# EAGLE design digitalLatchShieldSMD (EAGLE 7.3.0)
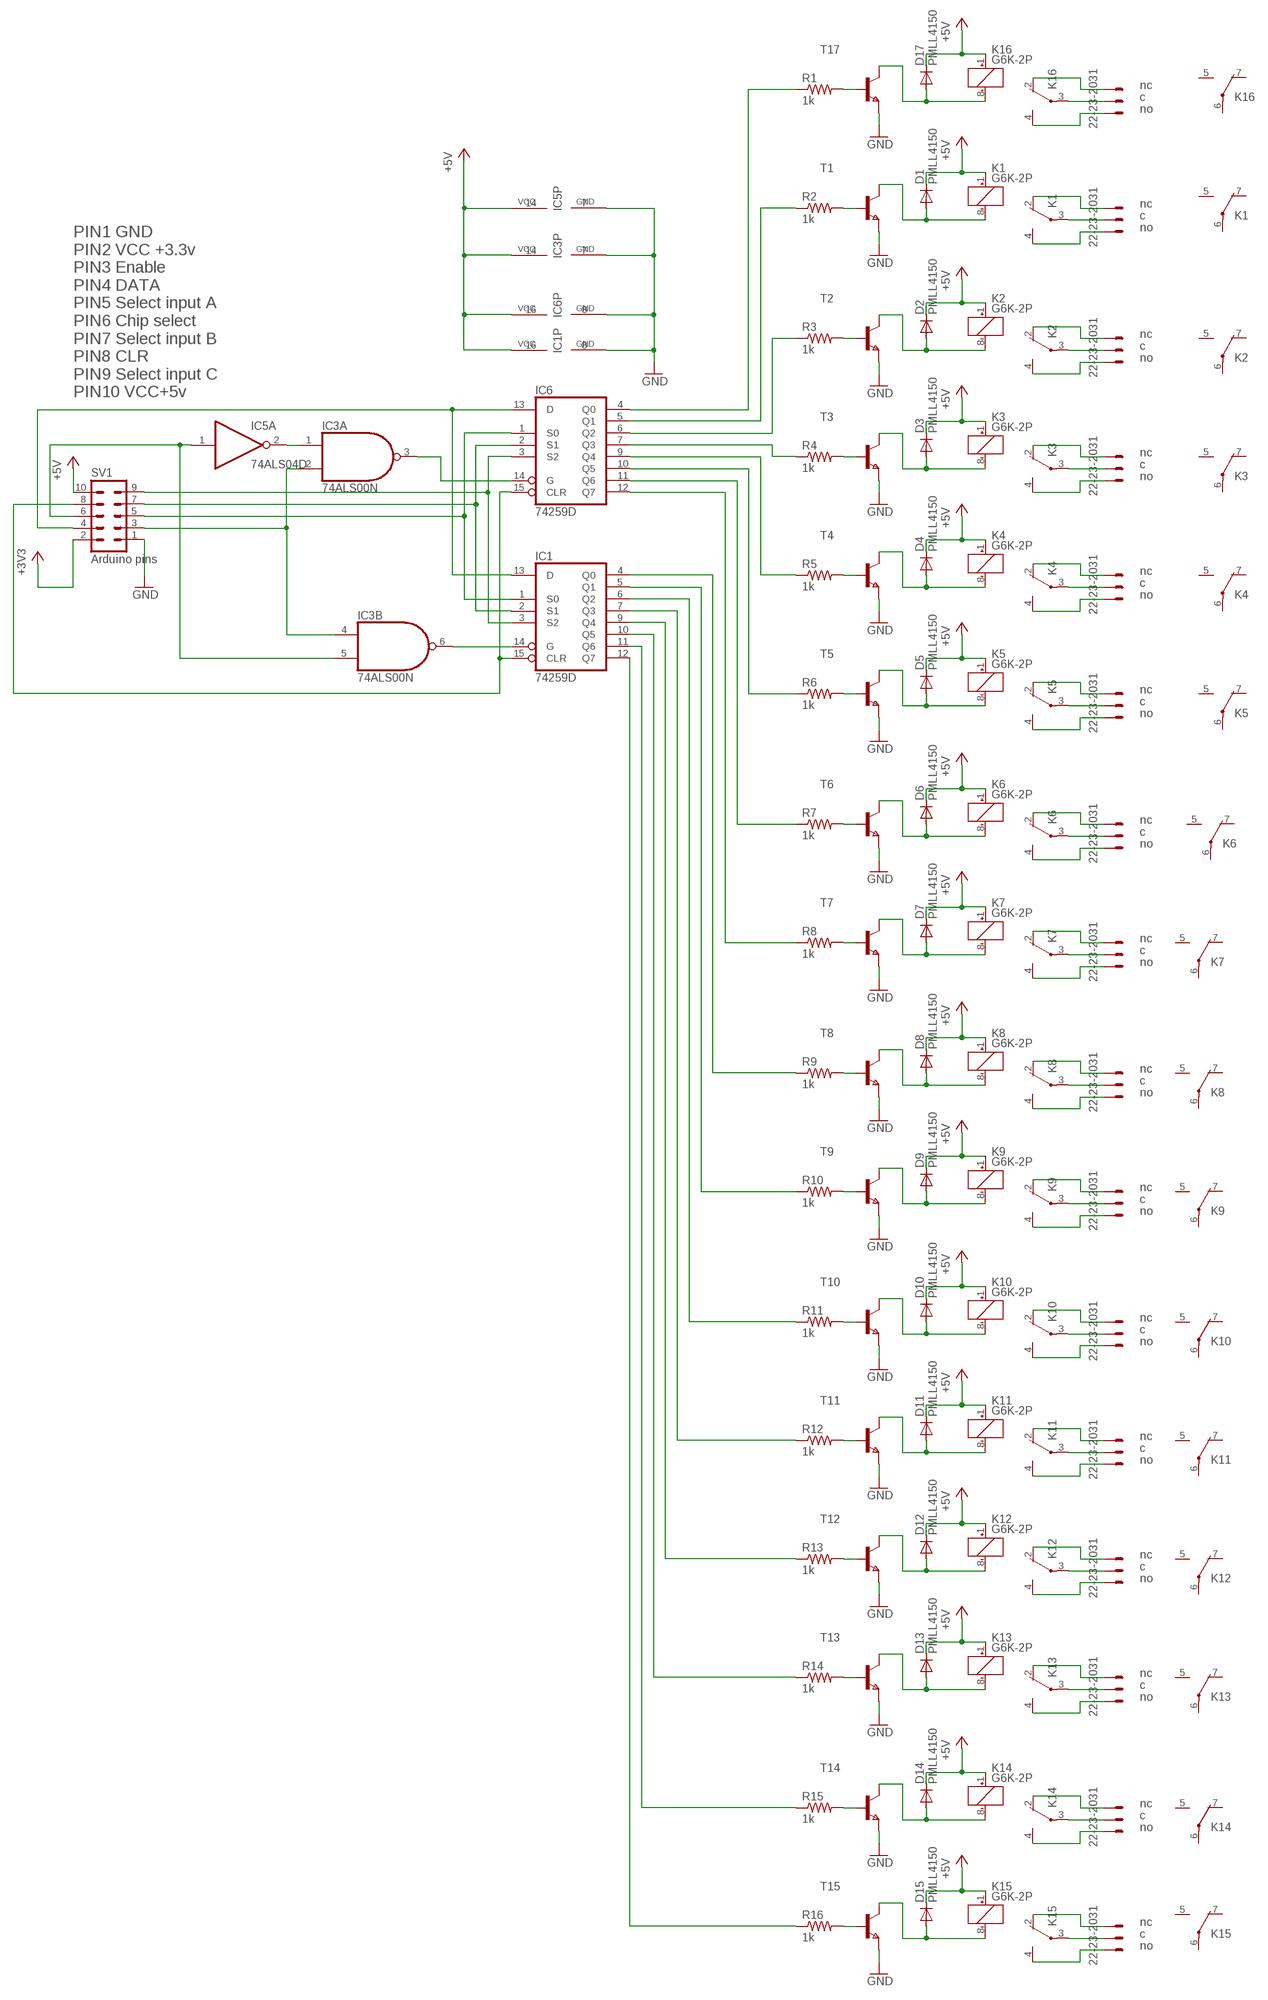
[diagram p0: schematic, sheet 1]

## Parts
D1  PMLL4150  [SOD80C]
D2  PMLL4150  [SOD80C]
D3  PMLL4150  [SOD80C]
D4  PMLL4150  [SOD80C]
D5  PMLL4150  [SOD80C]
D6  PMLL4150  [SOD80C]
D7  PMLL4150  [SOD80C]
D8  PMLL4150  [SOD80C]
D9  PMLL4150  [SOD80C]
D10  PMLL4150  [SOD80C]
D11  PMLL4150  [SOD80C]
D12  PMLL4150  [SOD80C]
D13  PMLL4150  [SOD80C]
D14  PMLL4150  [SOD80C]
D15  PMLL4150  [SOD80C]
D17  PMLL4150  [SOD80C]
IC1  74259D  [SO16]
IC3  74ALS00N  [DIL14]
IC5  74ALS04D  [SO14]
IC6  74259D  [SO16]
K1  G6K-2P  [G6K-2P]
K2  G6K-2P  [G6K-2P]
K3  G6K-2P  [G6K-2P]
K4  G6K-2P  [G6K-2P]
K5  G6K-2P  [G6K-2P]
K6  G6K-2P  [G6K-2P]
K7  G6K-2P  [G6K-2P]
K8  G6K-2P  [G6K-2P]
K9  G6K-2P  [G6K-2P]
K10  G6K-2P  [G6K-2P]
K11  G6K-2P  [G6K-2P]
K12  G6K-2P  [G6K-2P]
K13  G6K-2P  [G6K-2P]
K14  G6K-2P  [G6K-2P]
K15  G6K-2P  [G6K-2P]
K16  G6K-2P  [G6K-2P]
R1  1k  R-US_M0805  [M0805]
R2  1k  R-US_M0805  [M0805]
R3  1k  R-US_M0805  [M0805]
R4  1k  R-US_M0805  [M0805]
R5  1k  R-US_M0805  [M0805]
R6  1k  R-US_M0805  [M0805]
R7  1k  R-US_M0805  [M0805]
R8  1k  R-US_M0805  [M0805]
R9  1k  R-US_M0805  [M0805]
R10  1k  R-US_M0805  [M0805]
R11  1k  R-US_M0805  [M0805]
R12  1k  R-US_M0805  [M0805]
R13  1k  R-US_M0805  [M0805]
R14  1k  R-US_M0805  [M0805]
R15  1k  R-US_M0805  [M0805]
R16  1k  R-US_M0805  [M0805]
SV1  Arduino pins  MA05-2  [MA05-2]
T1  NPNSOT23  [SOT-23]
T2  NPNSOT23  [SOT-23]
T3  NPNSOT23  [SOT-23]
T4  NPNSOT23  [SOT-23]
T5  NPNSOT23  [SOT-23]
T6  NPNSOT23  [SOT-23]
T7  NPNSOT23  [SOT-23]
T8  NPNSOT23  [SOT-23]
T9  NPNSOT23  [SOT-23]
T10  NPNSOT23  [SOT-23]
T11  NPNSOT23  [SOT-23]
T12  NPNSOT23  [SOT-23]
T13  NPNSOT23  [SOT-23]
T14  NPNSOT23  [SOT-23]
T15  NPNSOT23  [SOT-23]
T17  NPNSOT23  [SOT-23]
X1  22-23-2031  [22-23-2031]
X2  22-23-2031  [22-23-2031]
X3  22-23-2031  [22-23-2031]
X4  22-23-2031  [22-23-2031]
X5  22-23-2031  [22-23-2031]
X6  22-23-2031  [22-23-2031]
X7  22-23-2031  [22-23-2031]
X8  22-23-2031  [22-23-2031]
X9  22-23-2031  [22-23-2031]
X10  22-23-2031  [22-23-2031]
X11  22-23-2031  [22-23-2031]
X12  22-23-2031  [22-23-2031]
X13  22-23-2031  [22-23-2031]
X14  22-23-2031  [22-23-2031]
X15  22-23-2031  [22-23-2031]
X16  22-23-2031  [22-23-2031]

## Nets
+3V3: SV1.2
+5V: D1.C D2.C D3.C D4.C D5.C D6.C D7.C D8.C D9.C D10.C D11.C D12.C D13.C D14.C D15.C D17.C IC1.16(VCC) IC3.14(P:VCC) IC5.14(P:VCC) IC6.16(VCC) K1.1(1:+) K2.1(1:+) K3.1(1:+) K4.1(1:+) K5.1(1:+) K6.1(1:+) K7.1(1:+) K8.1(1:+) K9.1(1:+) K10.1(1:+) K11.1(1:+) K12.1(1:+) K13.1(1:+) K14.1(1:+) K15.1(1:+) K16.1(1:+) SV1.10
GND: IC1.8(GND) IC3.7(P:GND) IC5.7(P:GND) IC6.8(GND) SV1.1 T1.2(E) T2.2(E) T3.2(E) T4.2(E) T5.2(E) T6.2(E) T7.2(E) T8.2(E) T9.2(E) T10.2(E) T11.2(E) T12.2(E) T13.2(E) T14.2(E) T15.2(E) T17.2(E)
N$1: IC3.3(A:O) IC6.14(G)
N$2: IC1.14(G) IC3.6(B:O)
N$3: IC1.3(S2) IC6.3(S2) SV1.9
N$4: IC1.2(S1) IC6.2(S1) SV1.7
N$5: IC1.1(S0) IC6.1(S0) SV1.5
N$6: R1.2 T17.3(B)
N$7: K16.3(2:P) X1.2
N$8: D17.A K16.8(1:-) T17.1(C)
N$9: K16.2(2:O) X1.1
N$10: K16.4(2:S) X1.3
N$11: R2.2 T1.3(B)
N$12: D1.A K1.8(1:-) T1.1(C)
N$13: K1.3(2:P) X2.2
N$14: K1.2(2:O) X2.1
N$15: K1.4(2:S) X2.3
N$16: R3.2 T2.3(B)
N$17: D2.A K2.8(1:-) T2.1(C)
N$18: K2.3(2:P) X3.2
N$19: K2.2(2:O) X3.1
N$20: K2.4(2:S) X3.3
N$21: R4.2 T3.3(B)
N$22: D3.A K3.8(1:-) T3.1(C)
N$23: K3.3(2:P) X4.2
N$24: K3.2(2:O) X4.1
N$25: K3.4(2:S) X4.3
N$26: R5.2 T4.3(B)
N$27: D4.A K4.8(1:-) T4.1(C)
N$28: K4.3(2:P) X5.2
N$29: K4.2(2:O) X5.1
N$30: K4.4(2:S) X5.3
N$31: R6.2 T5.3(B)
N$32: D5.A K5.8(1:-) T5.1(C)
N$33: K5.3(2:P) X6.2
N$34: K5.2(2:O) X6.1
N$35: K5.4(2:S) X6.3
N$36: R7.2 T6.3(B)
N$37: D6.A K6.8(1:-) T6.1(C)
N$38: K6.3(2:P) X7.2
N$39: K6.2(2:O) X7.1
N$40: K6.4(2:S) X7.3
N$41: R8.2 T7.3(B)
N$42: D7.A K7.8(1:-) T7.1(C)
N$43: K7.3(2:P) X8.2
N$44: K7.2(2:O) X8.1
N$45: K7.4(2:S) X8.3
N$46: R9.2 T8.3(B)
N$47: D8.A K8.8(1:-) T8.1(C)
N$48: K8.3(2:P) X9.2
N$49: K8.2(2:O) X9.1
N$50: K8.4(2:S) X9.3
N$51: R10.2 T9.3(B)
N$52: D9.A K9.8(1:-) T9.1(C)
N$53: K9.3(2:P) X10.2
N$54: K9.2(2:O) X10.1
N$55: K9.4(2:S) X10.3
N$56: R11.2 T10.3(B)
N$57: D10.A K10.8(1:-) T10.1(C)
N$58: K10.3(2:P) X11.2
N$59: K10.2(2:O) X11.1
N$60: K10.4(2:S) X11.3
N$61: R12.2 T11.3(B)
N$62: D11.A K11.8(1:-) T11.1(C)
N$63: K11.3(2:P) X12.2
N$64: K11.2(2:O) X12.1
N$65: K11.4(2:S) X12.3
N$66: R13.2 T12.3(B)
N$67: D12.A K12.8(1:-) T12.1(C)
N$68: K12.3(2:P) X13.2
N$69: K12.2(2:O) X13.1
N$70: K12.4(2:S) X13.3
N$71: R14.2 T13.3(B)
N$72: D13.A K13.8(1:-) T13.1(C)
N$73: K13.3(2:P) X14.2
N$74: K13.2(2:O) X14.1
N$75: K13.4(2:S) X14.3
N$76: R15.2 T14.3(B)
N$77: D14.A K14.8(1:-) T14.1(C)
N$78: K14.3(2:P) X15.2
N$79: K14.2(2:O) X15.1
N$80: K14.4(2:S) X15.3
N$81: R16.2 T15.3(B)
N$82: D15.A K15.8(1:-) T15.1(C)
N$83: K15.3(2:P) X16.2
N$84: K15.2(2:O) X16.1
N$85: K15.4(2:S) X16.3
N$86: IC6.4(Q0) R1.1
N$87: IC6.5(Q1) R2.1
N$88: IC6.6(Q2) R3.1
N$89: IC6.7(Q3) R4.1
N$90: IC6.9(Q4) R5.1
N$91: IC6.10(Q5) R6.1
N$92: IC6.11(Q6) R7.1
N$93: IC6.12(Q7) R8.1
N$94: IC1.4(Q0) R9.1
N$95: IC1.5(Q1) R10.1
N$96: IC1.6(Q2) R11.1
N$97: IC1.7(Q3) R12.1
N$98: IC1.9(Q4) R13.1
N$99: IC1.10(Q5) R14.1
N$100: IC1.11(Q6) R15.1
N$101: IC1.12(Q7) R16.1
N$102: IC1.15(CLR) IC6.15(CLR) SV1.8
N$103: IC3.2(A:I1) IC3.4(B:I0) SV1.3
N$105: IC3.5(B:I1) IC5.1(A:I) SV1.6
N$106: IC3.1(A:I0) IC5.2(A:O)
N$107: IC1.13(D) IC6.13(D) SV1.4
Unconnected: IC3.8(C:O) IC3.9(C:I0) IC3.10(C:I1) IC3.11(D:O) IC3.12(D:I0) IC3.13(D:I1) IC5.3(B:I) IC5.4(B:O) IC5.5(C:I) IC5.6(C:O) IC5.8(D:O) IC5.9(D:I) IC5.10(E:O) IC5.11(E:I) IC5.12(F:O) IC5.13(F:I) K1.5(3:S) K1.6(3:P) K1.7(3:O) K2.5(3:S) K2.6(3:P) K2.7(3:O) K3.5(3:S) K3.6(3:P) K3.7(3:O) K4.5(3:S) K4.6(3:P) K4.7(3:O) K5.5(3:S) K5.6(3:P) K5.7(3:O) K6.5(3:S) K6.6(3:P) K6.7(3:O) K7.5(3:S) K7.6(3:P) K7.7(3:O) K8.5(3:S) K8.6(3:P) K8.7(3:O) K9.5(3:S) K9.6(3:P) K9.7(3:O) K10.5(3:S) K10.6(3:P) K10.7(3:O) K11.5(3:S) K11.6(3:P) K11.7(3:O) K12.5(3:S) K12.6(3:P) K12.7(3:O) K13.5(3:S) K13.6(3:P) K13.7(3:O) K14.5(3:S) K14.6(3:P) K14.7(3:O) K15.5(3:S) K15.6(3:P) K15.7(3:O) K16.5(3:S) K16.6(3:P) K16.7(3:O)

## Notes on the sheet
- nc
- c
- no
- nc
- c
- no
- nc
- c
- no
- PIN1 GND
  PIN2 VCC +3.3v
  PIN3 Enable
  PIN4 DATA
  PIN5 Select input A
  PIN6 Chip select
  PIN7 Select input B
  PIN8 CLR
  PIN9 Select input C
  PIN10 VCC+5v
- nc
- c
- no
- nc
- c
- no
- nc
- c
- no
- nc
- c
- no
- nc
- c
- no
- nc
- c
- no
- nc
- c
- no
- nc
- c
- no
- nc
- c
- no
- nc
- c
- no
- nc
- c
- no
- nc
- c
- no
- nc
- c
- no

## Library data of the parts
D1-D15 D17 = diode:PMLL4150: DIODE high speed
IC1 IC6 = 74xx-us:74*259: 8-bit addressable LATCH
IC3 = 74xx-us:74*00: Quad 2-input NAND gate
IC5 = 74xx-us:74*04: Hex INVERTER
K1-K16 = relay:G6K: Low Signal Relay oeiwcsnts1.omron.com/.. D20G6K0100.pdf; MF: OMRON COMPONENTS USA; MPN: G6K-2P DC3; OC_FARNELL: 3937276; OC_NEWARK: 89C6482
R1-R16 = rcl:R-US_: RESISTOR, American symbol
SV1 = con-lstb:MA05-2: PIN HEADER; OC_FARNELL: unknown; OC_NEWARK: unknown
T1-T15 T17 = zetex:NPNSOT23: NPN TRANSISTOR; MPN: DSS20201L-7; OC_FARNELL: 1710688; OC_NEWARK: 25R4555
X1-X16 = con-molex:22-23-2031: .100" (2.54mm) Center Header - 3 Pin; MF: MOLEX; MPN: 22-23-2031; OC_FARNELL: 1462950; OC_NEWARK: 30C0862

## Board
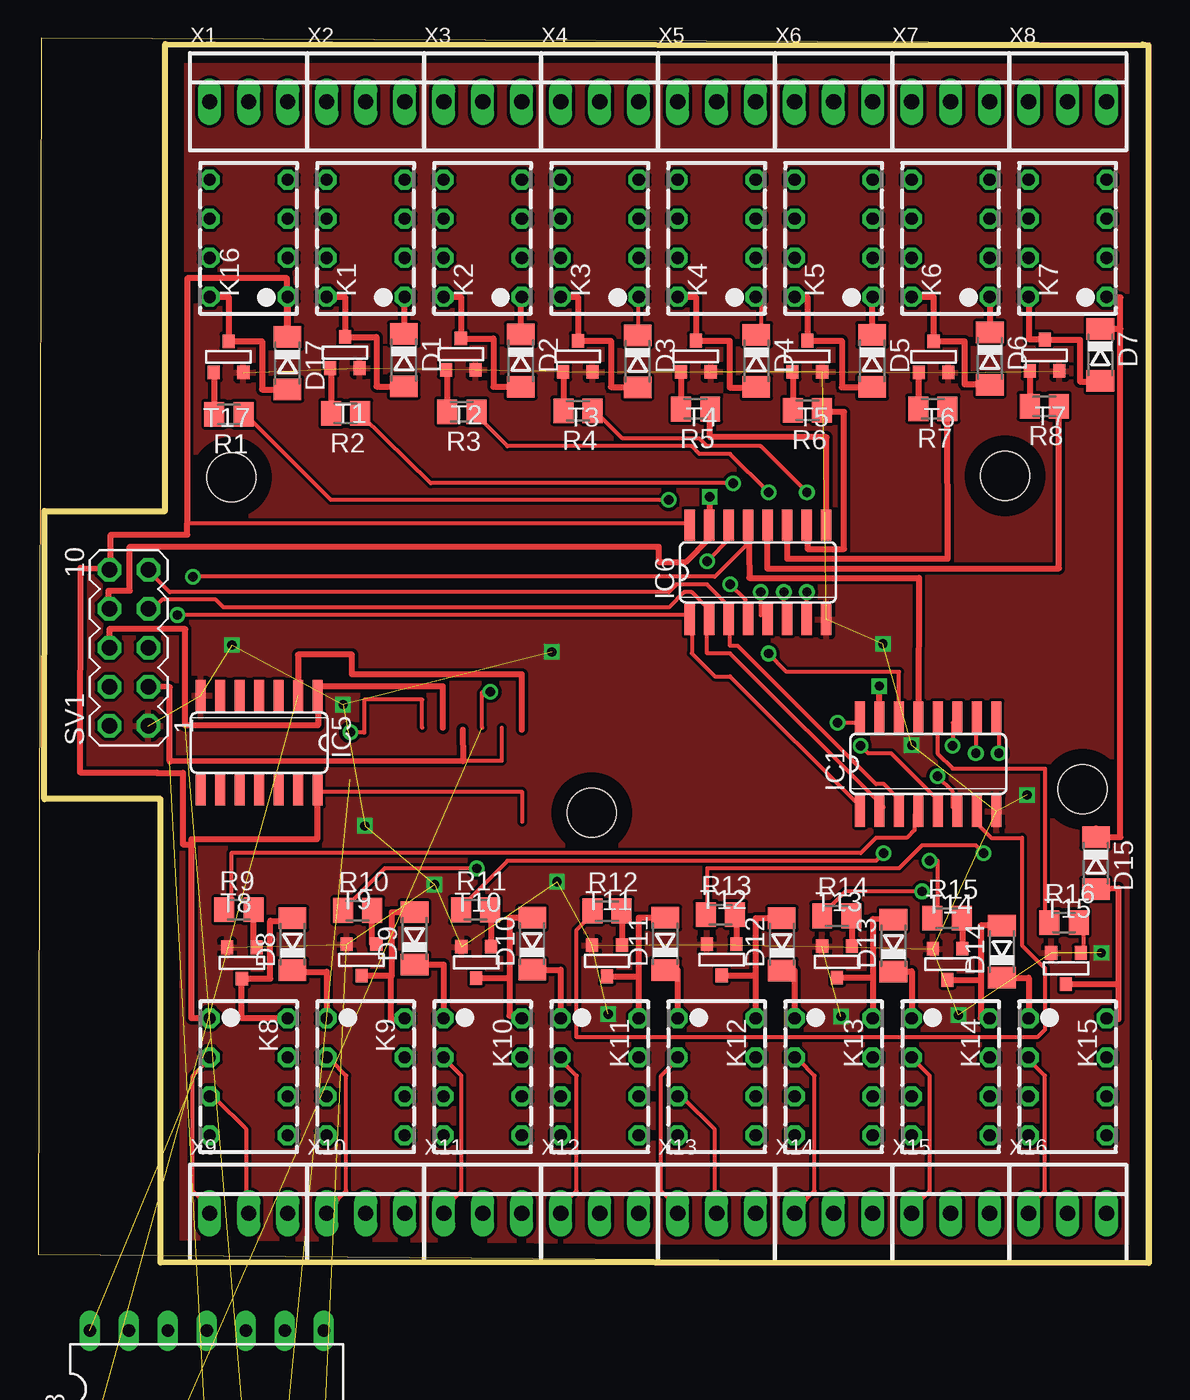
[diagram p1: board, top side]
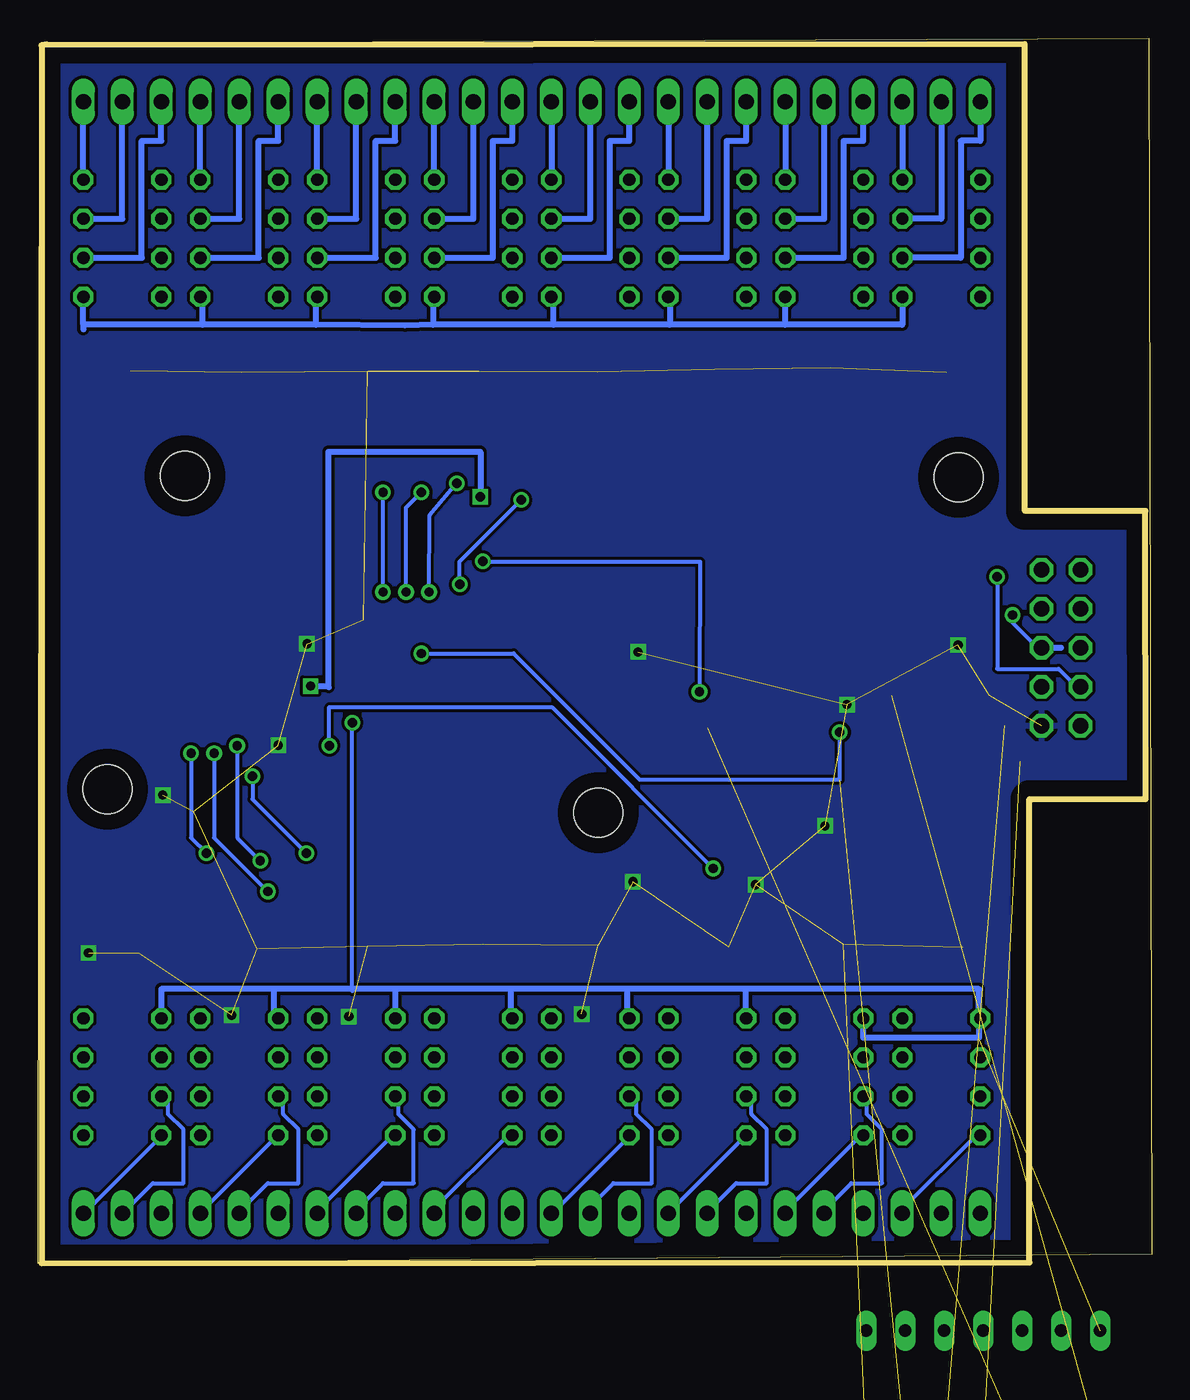
[diagram p2: board, bottom side, seen from below]

Size 72.5 x 79.78 mm. Coordinates in mm from the lower left corner, seen from the top.
Outline: 0.39,48.99 8.25,49 8.26,79.4 72.29,79.33
Outline: 71.93,79.39 72.29,79.33
Outline: 72.29,79.33 72.29,0.01 7.96,0.07 7.96,30.25 0.39,30.25 0.41,49
Outline: 0,0.6 72.5,0 72.41,79.45 0.18,79.78 0,0.6
Copper layers (1*16): Top 0.035mm / dielectric 1.5mm / Bottom 0.035mm
Design rules "default": minimum track width 10mil, minimum drill 24mil, track to track 8mil, track to pad 8mil, pad to pad 8mil, via to via 8mil, smd to smd 8mil, copper to edge 40mil, drill to drill 8mil, minimum pad ring 10mil, minimum via ring 8mil, stop-mask expansion 4mil, vias tented up to drill 0mil, thermal gap 10mil
Holes 3.2 mm at 12.57,51.19 62.96,51.3 36.04,29.35 68.01,30.88

### Footprints (pad centres in the part's own frame; a part is rotated, then mirrored left to right if it is on the bottom)
SOD80C = smd 1.4 x 1.8: A 1.7,0; C -1.7,0
SO16 = smd 0.66 x 2.032: 1 -4.445,-3.073; 2 -3.175,-3.073; 3 -1.905,-3.073; 4 -0.635,-3.073; 5 0.635,-3.073; 6 1.905,-3.073; 7 3.175,-3.073; 8 4.445,-3.073; 9 4.445,3.073; 10 3.175,3.073; 11 1.905,3.073; 12 0.635,3.073; 13 -0.635,3.073; 14 -1.905,3.073; 15 -3.175,3.073; 16 -4.445,3.073
DIL14 = drill 0.813 long: 1 -7.62,-3.81; 2 -5.08,-3.81; 3 -2.54,-3.81; 4 0,-3.81; 5 2.54,-3.81; 6 5.08,-3.81; 7 7.62,-3.81; 8 7.62,3.81; 9 5.08,3.81; 10 2.54,3.81; 11 0,3.81; 12 -2.54,3.81; 13 -5.08,3.81; 14 -7.62,3.81
SO14 = smd 0.66 x 2.032: 1 -3.81,-3.073; 2 -2.54,-3.073; 3 -1.27,-3.073; 4 0,-3.073; 5 1.27,-3.073; 6 2.54,-3.073; 7 3.81,-3.073; 8 3.81,3.073; 9 2.54,3.073; 10 1.27,3.073; 11 0,3.073; 12 -1.27,3.073; 13 -2.54,3.073; 14 -3.81,3.073
G6K-2P = drill 0.8 octagon: 1 -2.54,-2.54; 2 0,-2.54; 3 2.54,-2.54; 4 5.08,-2.54; 5 5.08,2.54; 6 2.54,2.54; 7 0,2.54; 8 -2.54,2.54
M0805 = smd 1.3 x 1.6: 1 -0.95,0; 2 0.95,0
MA05-2 = drill 1.016 octagon: 1 -5.08,-1.27; 2 -5.08,1.27; 3 -2.54,-1.27; 4 -2.54,1.27; 5 0,-1.27; 6 0,1.27; 7 2.54,-1.27; 8 2.54,1.27; 9 5.08,-1.27; 10 5.08,1.27
SOT-23 = smd 0.787 x 0.889: 1 0.025,-1.016; 2 -0.94,1.016; 3 0.991,1.016
22-23-2031 = drill 1 long: 1 -2.54,0; 2 0,0; 3 2.54,0

### Placement (x,y rotation side)
D1  23.81,58.83 270 top
D2  31.42,58.79 270 top
D3  39.03,58.75 270 top
D4  46.76,58.78 270 top
D5  54.3,58.77 270 top
D6  61.97,58.93 270 top
D7  69.16,59.16 270 top
D8  16.55,20.78 90 top
D9  24.5,21.16 90 top
D10  32.16,20.81 90 top
D11  40.83,20.81 90 top
D12  48.42,20.78 90 top
D13  55.69,20.7 90 top
D14  62.75,20.31 90 top
D15  68.88,26.06 270 top
D17  16.22,58.63 270 top
IC1  57.95,32.52 0 top
IC3  10.96,-8.19 0 top  (outside the outline)
IC5  14.38,33.91 180 top
IC6  46.87,45.01 0 top
K1  21.32,65.49 90 top
K2  28.94,65.49 90 top
K3  36.56,65.49 90 top
K4  44.18,65.49 90 top
K5  51.8,65.49 90 top
K6  59.42,65.49 90 top
K7  67.04,65.49 90 top
K8  13.7,13.42 270 top
K9  21.32,13.42 270 top
K10  28.94,13.42 270 top
K11  36.56,13.42 270 top
K12  44.18,13.42 270 top
K13  51.8,13.42 270 top
K14  59.42,13.42 270 top
K15  67.04,13.42 270 top
K16  13.7,65.49 90 top
R1  12.41,55.3 180 top
R2  20.02,55.36 180 top
R3  27.58,55.47 180 top
R4  35.14,55.53 180 top
R5  42.8,55.64 180 top
R6  50.09,55.57 180 top
R7  58.26,55.66 180 top
R8  65.51,55.83 180 top
R9  13.06,23.03 0 top
R10  20.8,22.99 0 top
R11  28.46,23.02 0 top
R12  37.03,22.95 0 top
R13  44.42,22.72 0 top
R14  52,22.63 0 top
R15  59.19,22.48 0 top
R16  66.8,22.2 0 top
SV1  5.89,40.09 90 top
T1  19.99,59.32 180 top
T2  27.54,59.22 180 top
T3  35.16,59.07 180 top
T4  42.85,59.08 180 top
T5  50.11,59.08 180 top
T6  58.33,59.04 180 top
T7  65.56,59.14 180 top
T8  13.23,19.56 0 top
T9  21.02,19.76 0 top
T10  28.49,19.6 0 top
T11  37.01,19.7 0 top
T12  44.48,19.77 0 top
T13  51.99,19.63 0 top
T14  59.19,19.48 0 top
T15  66.9,19.21 0 top
T17  12.41,59.04 180 top
X1  13.7,75.65 0 top
X2  21.32,75.65 0 top
X3  28.94,75.65 0 top
X4  36.56,75.65 0 top
X5  44.18,75.65 0 top
X6  51.8,75.65 0 top
X7  59.42,75.65 0 top
X8  67.04,75.65 0 top
X9  13.7,3.26 0 top
X10  21.32,3.26 0 top
X11  28.94,3.26 0 top
X12  36.56,3.26 0 top
X13  44.18,3.26 0 top
X14  51.8,3.26 0 top
X15  59.42,3.26 0 top
X16  67.04,3.26 0 top

### Tracks (layer width: path | path; a pad name or v marks a point on that pad's centre or on a via)
+5V  (via drill 0.61)  (1 unrouted)
  Top 0.254: D3.C 39.06,60.72 39.06,62.72 K3.1 | D4.C 47.06,60.72 47.06,62.72 K4.1 | 31.51,28.77 31.5,30.72 18.06,30.72 IC5.14 | v52.06,35.22 53.56,35.22 IC1.16 | 9.7,48.22 42.56,48.22 IC6.16
  Top 0.406: K6.1 61.97,62.95 D6.C | K5.1 54.3,62.95 D5.C | K2.1 31.42,62.95 D2.C | K1.1 23.81,62.95 D1.C | K16.1 16.22,62.95 D17.C 16.2,60.33 | D8.C 16.67,19.08 16.67,18.98 18.78,18.98 K9.1 | D9.C 26.4,19.46 K10.1 | D10.C 34.02,19.11 K11.1 | D11.C 41.64,19.11 K12.1 | D12.C 49.26,19.08 K13.1 | D13.C 56.88,19.02 K14.1 | D14.C 64.5,18.61 K15.1 | D7.C 70.48,60.86 | 70.48,60.86 70.48,62.91 69.58,62.91 K7.1 | 70.48,60.86 70.48,27.76 D15.C 68.88,28.35 | 16.15,60.33 16.2,60.33 | 16.2,60.33 16.2,64.16 9.7,64.16 9.7,48.22 9.7,47.46 4.72,47.46 4.72,45.25 4.62,45.25 | IC5.14 18.14,30.84 18.14,27.61 9.98,27.61 9.98,27.29 | 4.62,45.25 2.74,45.29 2.72,31.99 7.76,31.97 7.66,31.94 9.41,31.94 9.41,27.29 9.98,27.29 | 4.62,45.25 SV1.10 | K8.1 9.98,15.96 9.98,27.29
  Bottom 0.254: v52.06,35.22 52.06,17.86 52.06,17.72
  Bottom 0.406: K16.1 16.23,61.13 23.87,61.13 | 23.87,61.13 31.38,61.13 | 31.38,61.13 38.98,61.13 | 38.98,61.13 46.81,61.13 | 46.81,61.13 48.62,61.09 54.44,61.13 | 54.44,61.13 61.83,61.13 | 61.83,61.13 69.58,61.13 | 69.58,61.13 69.58,60.84 | 69.58,61.13 K7.1 | K6.1 61.83,62.95 61.83,61.13 | K5.1 54.44,62.95 54.44,61.13 | K3.1 38.98,62.95 38.98,61.13 | K2.1 31.38,62.95 31.38,61.13 | K1.1 23.87,62.95 23.87,61.13 | K4.1 46.81,62.95 46.81,61.13 | K8.1 11.26,15.96 11.26,17.86 | 11.26,17.86 26.43,17.86 | 26.43,17.86 34.15,17.86 | 34.15,17.86 41.74,17.86 | 41.74,17.86 49.24,17.86 | 49.24,17.86 52.06,17.86 57.16,17.86 | 57.16,17.86 64.5,17.86 K15.1 | K14.1 57.16,15.96 57.16,17.86 | K13.1 49.24,15.96 49.24,17.86 | K12.1 41.74,15.96 41.74,17.86 | K11.1 34.15,15.96 34.15,17.86 | K10.1 26.43,15.96 26.43,17.86 | 11.26,17.86 11.24,17.86 11.24,14.69 18.78,14.69 K9.1
GND  (via drill 0.6)  (33 unrouted)
  other vias: 19.84,36.39 21.27,28.49 33.44,39.82 25.8,24.67 33.78,24.86 37.12,16.24 52.28,16.08 59.92,16.17 69.24,20.22 64.4,30.5 55,40.35 56.88,33.74 12.6,40.27
  pour Bottom: 1.84,79.54 1.77,0.88 72.12,0.72 72.12,79.46
  pour Top: 1.69,79.45 1.61,0.25 72.12,0.72 72.12,79.46
N$1  (via drill 0.61)  (1 unrouted)
  Top 0.254: v29.44,37.23 28.91,37.21 28.91,34.87 | v43.56,45.72 45.06,47.22 45.06,47.72 IC6.14
  Bottom 0.254: v29.44,37.23 29.41,45.7 v43.56,45.72
N$2  (via drill 0.61)  (1 unrouted)
  Top 0.254: v47.56,39.72 48.73,38.52 56.05,38.52 56.06,36.22 56.06,35.72 IC1.14 | 25.01,34.87 25.01,36.72 21.23,36.72 21.23,34.57 20.31,34.57 v20.31,34.59
  Bottom 0.254: v47.56,39.72 41.56,39.72 33.34,31.51 20.31,31.51 v20.31,34.59
N$3
  Top 0.254: IC1.3 56.06,29.72 56.06,30.22 55.06,31.22 54.56,31.22 45.56,40.22 45.06,40.22 45.06,41.72 IC6.3 45.06,42.22 45.06,42.72 43.56,44.22 41.56,44.22 41.06,43.72 8.56,43.72 7.56,44.72 SV1.9
N$4
  Top 0.254: IC1.2 55.06,29.72 45.06,39.72 43.56,39.72 43.56,41.72 IC6.2 43.56,42.22 43.56,42.72 42.56,43.72 42.06,43.72 41.06,42.72 12.06,42.72 11.56,43.22 8.06,43.22 7.56,42.72 SV1.7
N$5  (via drill 0.61)
  Top 0.254: IC1.1 53.56,29.72 45.06,38.22 44.06,38.22 42.56,39.72 42.56,41.72 IC6.1 42.56,42.22 v9.06,42.22
  Bottom 0.254: v9.06,42.22 9.06,41.72 7.56,40.22 SV1.5
  Bottom 0.406: 5.9,40.09 SV1.5
N$6
  Top 0.406: T17.3 11.46,58.02 R1.2
N$7
  Bottom 0.406: X1.2 13.7,68.03 K16.3
N$8
  Top 0.406: K16.8 12.39,62.95 T17.1 14.56,60.06 14.56,56.92 16.22,56.92 D17.A
N$9
  Bottom 0.406: X1.1 11.16,73.11 12.43,73.11 12.43,65.49 K16.2
N$10
  Bottom 0.406: X1.3 K16.4
N$11
  Top 0.406: T1.3 19.07,58.3 R2.2
N$12
  Top 0.406: K1.8 19.97,62.95 T1.1 22.01,60.34 22.01,57.11 23.81,57.11 D1.A
N$13
  Bottom 0.406: K1.3 21.32,68.03 X2.2
N$14
  Bottom 0.406: K1.2 20.05,65.49 20.05,73.11 18.78,73.11 X2.1
N$15
  Bottom 0.406: X2.3 K1.4
N$16
  Top 0.406: T2.3 26.63,58.2 R3.2
N$17
  Top 0.406: K2.8 27.51,62.95 T2.1 29.64,60.23 29.64,57.09 D2.A | D2.A
N$18
  Bottom 0.406: K2.3 28.94,68.03 X3.2
N$19
  Bottom 0.406: K2.2 27.67,65.49 27.67,73.11 26.4,73.11 X3.1
N$20
  Bottom 0.406: X3.3 K2.4
N$21
  Top 0.406: T3.3 34.19,58.06 R4.2
N$22
  Top 0.406: K3.8 35.13,62.95 T3.1 37.29,60.09 37.29,57.07 39.03,57.07 D3.A
N$23
  Bottom 0.406: K3.3 36.56,68.03 X4.2
N$24
  Bottom 0.406: K3.2 35.29,65.49 35.29,73.11 34.02,73.11 X4.1
N$25
  Bottom 0.406: X4.3 K3.4
N$26
  Top 0.406: T4.3 R5.2
N$27
  Top 0.406: K4.8 42.83,62.95 T4.1 45.02,60.1 45.02,57.05 46.76,57.05 D4.A
N$28
  Bottom 0.406: K4.3 44.18,68.03 X5.2
N$29
  Bottom 0.406: K4.2 42.91,65.49 42.91,73.11 41.64,73.11 X5.1
N$30
  Bottom 0.406: K4.4 X5.3
N$31
  Top 0.406: T5.3 49.14,58.06 R6.2
N$32
  Top 0.406: K5.8 50.08,62.95 T5.1 52.32,60.1 52.32,57.07 D5.A
N$33
  Bottom 0.406: K5.3 51.8,68.03 X6.2
N$34
  Bottom 0.406: K5.2 50.53,65.49 50.53,73.11 49.26,73.11 X6.1
N$35
  Bottom 0.406: K5.4 X6.3
N$36
  Top 0.406: T6.3 57.31,58.02 R7.2
N$37
  Top 0.406: K6.8 58.31,62.95 T6.1 60.32,60.06 60.32,57.26 61.97,57.26 D6.A
N$38
  Bottom 0.406: K6.3 59.42,68.03 X7.2
N$39
  Bottom 0.406: K6.2 58.15,65.49 58.15,73.11 56.88,73.11 X7.1
N$40
  Bottom 0.406: K6.4 X7.3
N$41
  Top 0.406: T7.3 64.56,58.13 R8.2
N$42
  Top 0.406: K7.8 64.5,60.2 65.54,60.2 T7.1 67.83,60.16 67.83,57.43 69.58,57.43 D7.A
N$43
  Bottom 0.406: K7.3 67.04,68.03 X8.2
N$44
  Bottom 0.406: K7.2 65.77,65.49 65.77,73.11 64.5,73.11 X8.1
N$45
  Bottom 0.406: K7.4 X8.3
N$46
  Top 0.406: T8.3 14.01,20.58 R9.2
N$47
  Top 0.406: K8.8 13.26,15.96 T8.1 15.11,18.55 15.11,22.32 16.55,22.32 D8.A
N$48
  Top 0.254: K8.3 11.56,10.72 13.56,8.72 13.56,3.72 X9.2
N$49
  Top 0.254: K8.2 11.06,13.22 10.06,12.22 10.06,4.72 11.06,3.72 X9.1
N$50
  Bottom 0.254: K8.4 11.56,8.22 16.06,3.72 X9.3
N$51
  Top 0.406: T9.3 21.75,20.78 R10.2
N$52
  Top 0.406: D9.A 23.01,22.86 23.01,18.75 22.95,18.75 | T9.1 22.95,18.75 | 22.95,18.75 22.95,15.91 23.86,15.91 K9.8
N$53
  Bottom 0.254: K9.3 18.56,10.72 18.56,9.72 17.56,8.72 17.56,5.22 19.56,5.22 21.06,3.72 X10.2
N$54
  Top 0.254: K9.2 19.06,13.22 20.06,12.22 20.06,4.72 19.06,3.72 X10.1
N$55
  Bottom 0.254: K9.4 19.06,8.22 23.56,3.72 X10.3
N$56
  Top 0.406: R11.2 29.48,23.02 T10.3
N$57
  Top 0.406: D10.A 30.68,22.51 30.68,18.59 | 30.68,18.59 30.68,16.13 31.48,16.13 K10.8 | T10.1 30.68,18.59
N$58
  Bottom 0.254: K10.3 26.06,10.72 26.06,9.72 25.06,8.72 25.06,5.22 27.06,5.22 28.56,3.72 X11.2
N$59
  Top 0.254: K10.2 26.56,13.22 27.56,12.22 27.56,4.72 26.56,3.72 X11.1
N$60
  Bottom 0.254: K10.4 26.56,8.22 31.06,3.72 X11.3
N$61
  Top 0.406: R12.2 38,22.95 T11.3
N$62
  Top 0.406: D11.A 39.1,22.51 39.1,18.69 | 39.1,18.69 K11.8 | T11.1 39.1,18.69
N$63
  Bottom 0.254: K11.3 33.56,10.72 33.56,9.72 32.56,8.72 32.56,5.22 35.06,5.22 36.56,3.72 X12.2
N$64
  Top 0.254: K11.2 34.06,13.22 35.06,12.22 35.06,4.72 34.06,3.72 X12.1
N$65
  Bottom 0.254: K11.4 34.06,8.22 38.56,3.72 39.06,3.72 X12.3
N$66
  Top 0.406: R13.2 45.47,22.72 T12.3
N$67
  Top 0.406: D12.A 46.72,22.48 46.72,18.76 | 46.72,18.76 K12.8 | T12.1 46.72,18.76
N$68
  Top 0.254: K12.3 42.06,10.72 44.06,8.72 44.06,3.72 X13.2
N$69
  Top 0.254: K12.2 41.56,13.22 40.56,12.22 40.56,4.72 41.56,3.72 X13.1
N$70
  Bottom 0.254: K12.4 42.06,8.22 46.56,3.72 X13.3
N$71
  Top 0.254: 52.98,22.22 53.06,22.22 R14.2
  Top 0.406: 52.98,22.63 52.98,22.22 T13.3
N$72
  Top 0.406: D13.A 54.34,22.42 54.34,18.62 | 54.34,18.62 K13.8 | T13.1 54.34,18.62
N$73
  Bottom 0.254: K13.3 49.06,10.72 49.06,9.72 48.06,8.72 48.06,5.22 50.06,5.22 51.56,3.72 X14.2
N$74
  Top 0.254: K13.2 49.56,13.22 50.56,12.22 50.56,4.72 49.56,3.72 X14.1
N$75
  Bottom 0.254: K13.4 49.56,8.22 54.06,3.72 X14.3
N$76
  Top 0.406: R15.2 60.18,22.48 T14.3
N$77
  Top 0.406: D14.A 61.37,22.01 61.37,18.46 | 61.37,18.46 61.37,15.97 61.96,15.97 K14.8 | T14.1 61.37,18.46
N$78
  Bottom 0.254: K14.3 56.56,10.72 56.56,9.72 55.56,8.72 55.56,5.22 57.56,5.22 59.06,3.72 X15.2
N$79
  Top 0.254: K14.2 57.06,13.22 58.06,12.22 58.06,4.72 57.06,3.72 X15.1
N$80
  Bottom 0.254: K14.4 57.06,8.22 61.56,3.72 X15.3
N$81
  Top 0.254: T15.3 68.06,20.22 68.06,21.72 R16.2
N$82
  Top 0.406: D15.A 70.34,24.44 70.34,18.19 | 70.34,18.19 70.34,15.91 69.58,15.91 K15.8 | T15.1 70.34,18.19
N$83
  Bottom 0.254: K15.3 64.06,10.72 64.06,9.72 63.06,8.72 63.06,5.22 65.06,5.22 66.56,3.72 X16.2
N$84
  Top 0.254: K15.2 64.56,13.22 65.56,12.22 65.56,4.72 64.56,3.72 X16.1
N$85
  Bottom 0.254: K15.4 64.56,8.22 69.06,3.72 69.56,3.72 X16.3
N$86  (via drill 0.61)
  Top 0.254: v41.06,49.72 19.06,49.72 13.56,55.22 R1.1 | v45.06,44.22 46.06,43.22 46.06,42.22 IC6.4
  Bottom 0.254: v41.06,49.72 45.06,45.72 v45.06,44.22
N$87  (via drill 0.61)
  Top 0.254: v45.25,50.81 25.56,50.81 21.06,55.22 R2.1 | v47.06,43.72 47.06,42.22 47.56,42.22 IC6.5
  Bottom 0.254: v45.25,50.81 47.01,48.72 v47.06,43.72
N$88  (via drill 0.61)
  Top 0.254: v47.56,50.22 45.06,52.72 43.06,52.72 42.56,53.22 30.56,53.22 28.56,55.22 R3.1 | v48.56,43.72 48.56,42.22 IC6.6
  Bottom 0.254: v47.56,50.22 48.56,49.22 v48.56,43.72
N$89  (via drill 0.61)
  Top 0.254: v50.06,50.22 47.06,53.22 43.56,53.22 43.06,53.72 38.06,53.72 36.56,55.22 R4.1 | v50.06,43.72 50.06,42.22 IC6.7
  Bottom 0.254: v50.06,43.72 v50.06,50.22
N$90
  Top 0.406: IC6.9 51.33,48.08 51.33,53.8 43.76,53.8 R5.1
N$91
  Top 0.406: IC6.10 50.09,48.08 50.09,46.53 52.48,46.53 52.48,55.44 51.04,55.44 R6.1
N$92
  Top 0.406: IC6.11 48.75,48.08 48.76,45.89 59.23,45.89 R7.1
N$93
  Top 0.406: IC6.12 47.46,48.08 47.46,45.26 66.46,45.26 R8.1
N$94
  Top 0.254: R9.1 12.56,23.22 12.56,26.72 53.56,26.72 54.56,27.72 56.56,27.72 57.06,28.22 57.06,29.22 IC1.4
N$95  (via drill 0.61)
  Top 0.254: v28.56,25.72 22.56,25.72 20.06,23.22 R10.1 | v53.56,33.72 54.06,33.22 55.56,33.22 58.56,30.22 58.56,29.72 IC1.5
  Bottom 0.254: v28.56,25.72 39.06,36.22 53.56,36.22 v53.56,33.72
N$96  (via drill 0.61)
  Top 0.254: v55.06,26.72 54.56,26.22 30.56,26.22 27.56,23.22 R11.1 | v58.56,31.72 59.56,30.72 59.56,29.72 IC1.6
  Bottom 0.254: v55.06,26.72 58.56,30.22 v58.56,31.72
N$97
  Top 0.254: R12.1 36.06,22.72 35.06,21.72 35.06,14.72 65.06,14.72 65.56,15.22 65.56,19.22 64.06,20.72 64.06,27.72 62.06,27.72 61.06,28.72 61.06,29.22 IC1.7
N$98  (via drill 0.61)
  Top 0.254: v61.56,26.72 61.06,27.22 57.56,27.22 56.06,25.72 43.56,25.72 43.56,22.72 R13.1 | v62.56,33.22 62.56,35.22 IC1.9
  Bottom 0.254: v61.56,26.72 62.56,27.72 v62.56,33.22
N$99  (via drill 0.61)
  Top 0.254: v57.56,24.22 52.56,24.22 51.06,22.72 R14.1 | v61.06,33.22 61.06,35.22 IC1.10
  Bottom 0.254: v57.56,24.22 61.06,27.72 v61.06,33.22
N$100  (via drill 0.61)
  Top 0.254: v58.06,26.22 58.56,26.22 58.56,22.72 R15.1 | v59.56,33.72 59.56,35.22 IC1.11
  Bottom 0.254: v58.06,26.22 59.56,27.72 v59.56,33.72
N$101
  Top 0.254: R16.1 65.56,22.22 65.56,32.22 59.56,32.22 58.56,33.22 58.56,35.22 IC1.12
N$102  (via drill 0.6)
  Top 0.406: SV1.8 4.58,42.63 4.58,43.81 5.95,43.81 5.95,46.68 40.4,46.68 40.4,45.69 42.16,45.69 43.68,47.21 43.68,48.07 IC6.15 43.8,48.19 43.8,48.72 43.72,48.79 v43.72,49.92 | IC1.15 v54.78,37.59 v54.77,37.59
  Bottom 0.406: v54.77,37.59 53.65,37.59 53.59,37.53 53.59,52.84 53.61,52.86 43.72,52.86 43.71,52.84 43.71,49.94 v43.72,49.92
N$103  (2 unrouted)
  Top 0.254: 30.17,34.87 30.17,32.73 27.66,32.73 27.66,32.71
  Top 0.406: 27.64,34.76 27.66,32.71 8.56,32.68 8.56,37.54 7.16,37.57 SV1.3
N$105  (1 unrouted)
  Top 0.406: SV1.6 4.62,41.3 9.55,41.3 9.55,41.31 9.56,41.29 9.55,35.04 18.21,35.04 18.21,36.98 IC5.1 18.19,37.58 26.34,37.58 26.34,34.87
N$106  (1 unrouted)
  Top 0.406: 31.49,34.77 31.49,38.37 20.42,38.37 20.42,39.65 16.92,39.65 IC5.2
N$107  (via drill 0.61)
  Top 0.254: v10.06,44.72 44.06,44.72 46.06,46.72 46.06,47.72 IC6.13
  Top 0.406: IC6.13 46.26,48.08 46.3,44.64 57.36,44.64 IC1.13
  Bottom 0.254: v10.06,44.72 10.06,38.72 6.06,38.72 5.06,37.72 SV1.4